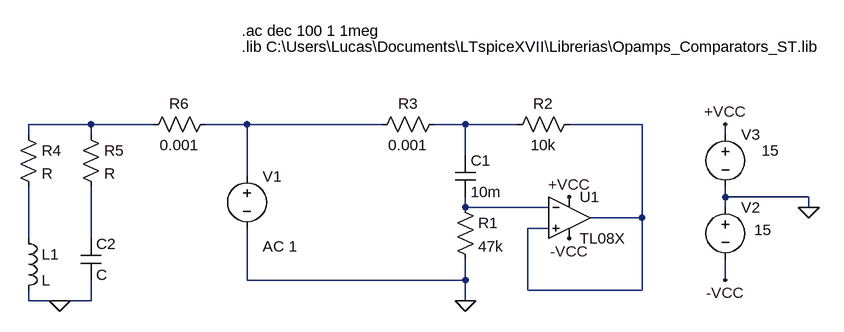
[diagram p0: schematic gyrator.asc]
gyrator.asc, the LTspice schematic file:
Version 4
SHEET 1 964 680
WIRE -400 16 -496 16
WIRE -304 16 -400 16
WIRE -160 16 -224 16
WIRE 48 16 -160 16
WIRE 176 16 128 16
WIRE 256 16 176 16
WIRE 448 16 336 16
WIRE -496 32 -496 16
WIRE -400 32 -400 16
WIRE 576 32 576 16
WIRE 176 64 176 16
WIRE -160 96 -160 16
WIRE 576 128 576 112
WIRE 704 128 576 128
WIRE 176 144 176 128
WIRE 304 144 176 144
WIRE 576 144 576 128
WIRE 704 144 704 128
WIRE 448 160 448 16
WIRE 448 160 368 160
WIRE 304 176 272 176
WIRE -496 192 -496 112
WIRE -400 192 -400 112
WIRE -160 256 -160 176
WIRE 176 256 176 224
WIRE 176 256 -160 256
WIRE 576 256 576 224
WIRE 272 272 272 176
WIRE 448 272 448 160
WIRE 448 272 272 272
WIRE -496 288 -496 272
WIRE -448 288 -496 288
WIRE -400 288 -400 256
WIRE -400 288 -448 288
WIRE 176 288 176 256
FLAG 704 144 0
FLAG 576 16 +VCC
FLAG 576 256 -VCC
FLAG 176 288 0
FLAG 336 128 +VCC
FLAG 336 192 -VCC
FLAG -448 288 0
SYMBOL voltage -160 80 R0
WINDOW 123 24 124 Left 2
WINDOW 39 0 0 Left 0
SYMATTR Value2 AC 1
SYMATTR InstName V1
SYMATTR Value ""
SYMBOL voltage 576 128 R0
WINDOW 3 44 51 Left 2
WINDOW 123 24 124 Left 2
WINDOW 39 0 0 Left 0
SYMATTR Value 15
SYMATTR InstName V2
SYMBOL voltage 576 16 R0
WINDOW 3 56 40 Left 2
WINDOW 123 24 124 Left 2
WINDOW 39 0 0 Left 0
SYMATTR Value 15
SYMATTR InstName V3
SYMBOL cap 160 64 R0
SYMATTR InstName C1
SYMATTR Value 10m
SYMBOL res 160 128 R0
SYMATTR InstName R1
SYMATTR Value 47k
SYMBOL res 352 0 R90
WINDOW 0 0 56 VBottom 2
WINDOW 3 32 56 VTop 2
SYMATTR InstName R2
SYMATTR Value 10k
SYMBOL Opamps\\opamp2 336 96 R0
SYMATTR InstName U1
SYMATTR Value TL08X
SYMBOL res 144 0 R90
WINDOW 0 0 56 VBottom 2
WINDOW 3 32 56 VTop 2
SYMATTR InstName R3
SYMATTR Value 0.001
SYMBOL res -512 16 R0
SYMATTR InstName R4
SYMBOL ind -512 176 R0
SYMATTR InstName L1
SYMBOL res -416 16 R0
SYMATTR InstName R5
SYMBOL cap -416 192 R0
SYMATTR InstName C2
SYMBOL res -208 0 R90
WINDOW 0 0 56 VBottom 2
WINDOW 3 32 56 VTop 2
SYMATTR InstName R6
SYMATTR Value 0.001
TEXT -168 -128 Left 2 !.ac dec 100 1 1meg
TEXT -168 -104 Left 2 !.lib C:\\Users\\Lucas\\Documents\\LTspiceXVII\\Librerias\\Opamps_Comparators_ST.lib

The netlist it stands for:
* gyrator.asc
V1 N002 0 AC 1
V2 0 -VCC 15
V3 +VCC 0 15
C1 N003 N005 10m
R1 N005 0 47k
R2 N004 N003 10k
XU1 N004 N005 +VCC -VCC N004 TL08X  ; pins In+ In- V+ V- OUT
R3 N003 N002 0.001
R4 N001 N006 R
L1 N006 0 L
R5 N001 N007 R
C2 N007 0 C
R6 N002 N001 0.001
.ac dec 100 1 1meg
.lib C:\Users\Lucas\Documents\LTspiceXVII\Librerias\Opamps_Comparators_ST.lib
.backanno
.end